# Altium schematic sheet BMS-S01-V00-BatteryManagementSystem.SchDoc: BMS Master
size A3; DrawnBy: Jonn Dillon; DocumentNumber: 1; Revision: 01; SheetNumber: 1; SheetTotal: 10; Version: 01; Project: Battery Managment System 2020; PageSetup: Record=PageOptions|CenterHorizontal=True|CenterVertical=True|PrintScale=0.97|XCorrection=1.00|YCorrection=1.00|PrintKind=0|BorderSize=5000000|LeftOffset=0|BottomOffset=0|Orientation=2|PaperLength=1000|PaperWidth=1000|Scale=100|PaperSource=7|PrintQuality=-4|MediaType=1|DitherType=10|PaperKind=A4|PrintScaleMode=1
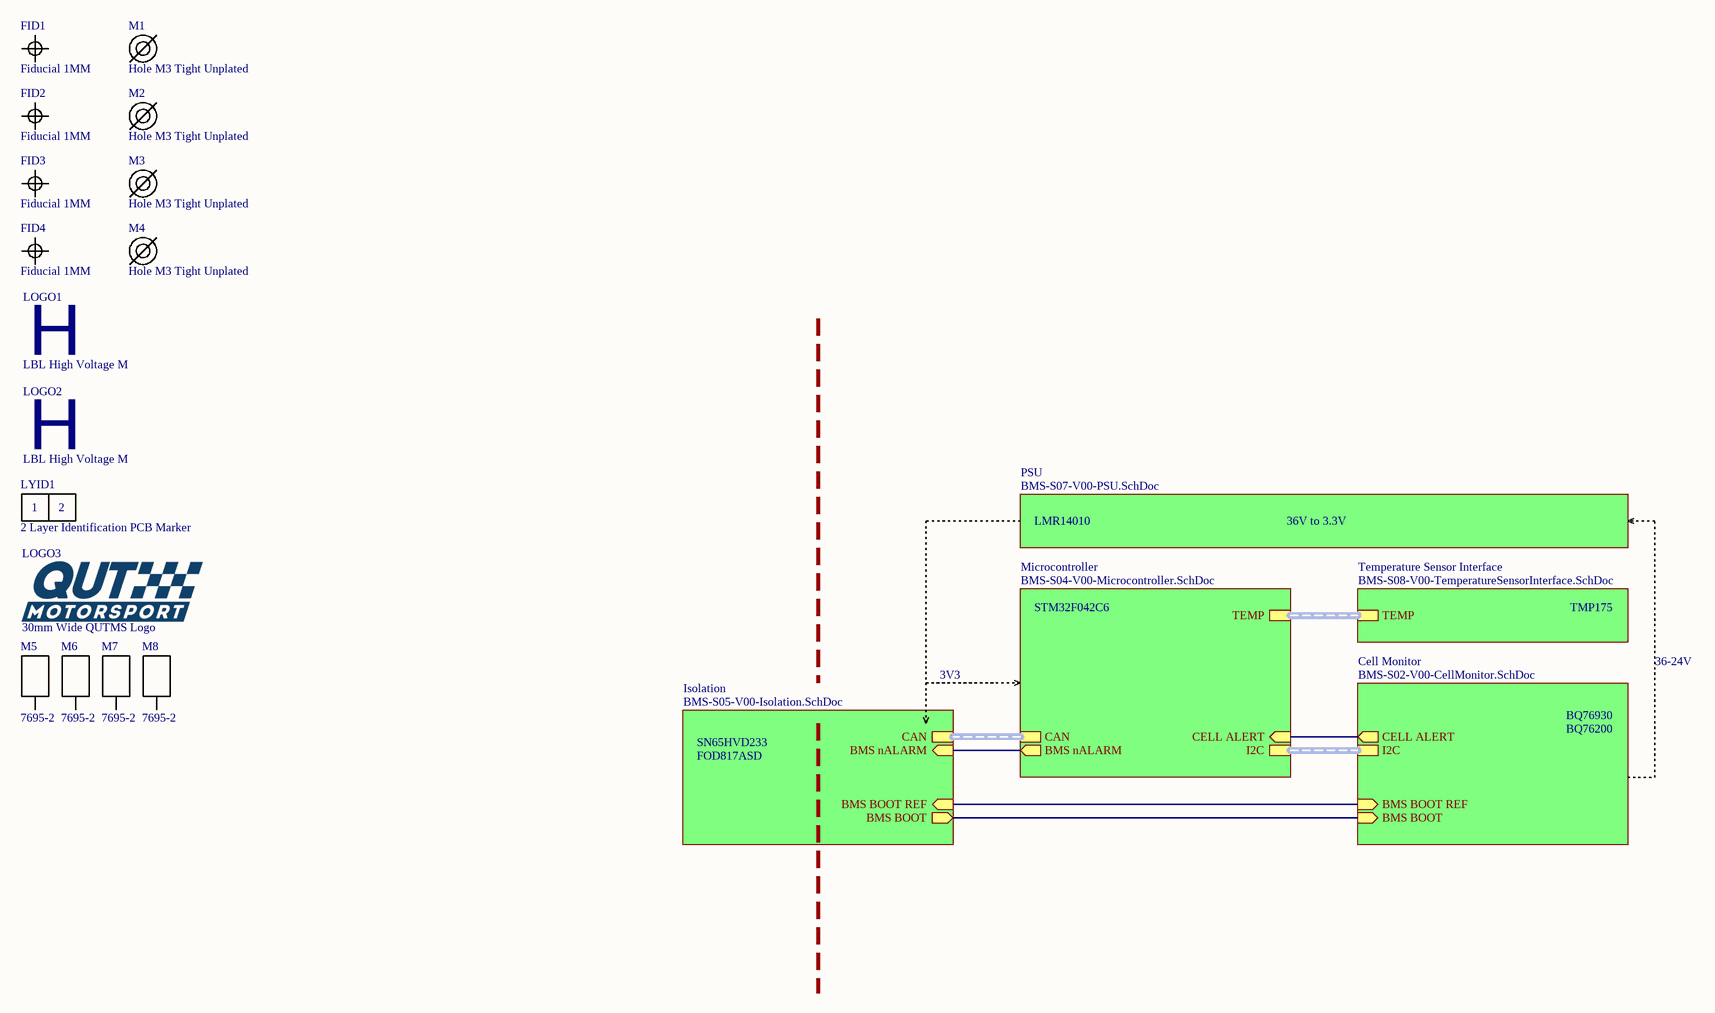
[diagram p0: BMS-S01-V00-BatteryManagementSystem.SchDoc]

## Parts
FID1  Fiducial 1MM  [FIDUCIAL 1MM]
FID2  Fiducial 1MM  [FIDUCIAL 1MM]
FID3  Fiducial 1MM  [FIDUCIAL 1MM]
FID4  Fiducial 1MM  [FIDUCIAL 1MM]
LOGO1  LBL High Voltage M  [LBL HV MEDIUM]
LOGO2  LBL High Voltage M  [LBL HV MEDIUM]
LOGO3  30mm Wide QUTMS Logo  [QUTMS LOGO 30MM]
LYID1  2 Layer Identification PCB Marker  [LAYER IDENT 2]
M1  Hole M3 Tight Unplated  [M3.2 UNPLATED]
M2  Hole M3 Tight Unplated  [M3.2 UNPLATED]
M3  Hole M3 Tight Unplated  [M3.2 UNPLATED]
M4  Hole M3 Tight Unplated  [M3.2 UNPLATED]
M5  7695-2  [Keystone 7790]
M6  7695-2  [Keystone 7790]
M7  7695-2  [Keystone 7790]
M8  7695-2  [Keystone 7790]

## Sub-sheets
Cell Monitor = BMS-S02-V00-CellMonitor.SchDoc: BMS BOOT REF (in), BMS BOOT (in), I2C (harness I2C), CELL ALERT (out)
Isolation = BMS-S05-V00-Isolation.SchDoc: BMS BOOT (out), BMS nALARM (in), BMS BOOT REF (in), CAN (harness CAN)
Microcontroller = BMS-S04-V00-Microcontroller.SchDoc: I2C (harness I2C), CAN (harness CAN), BMS nALARM (out), CELL ALERT (in), TEMP (harness TEMP)
PSU = BMS-S07-V00-PSU.SchDoc: no entries
Temperature Sensor Interface = BMS-S08-V00-TemperatureSensorInterface.SchDoc: TEMP (harness TEMP)

## Nets
(unnamed): sheet Isolation/BMS BOOT, sheet Cell Monitor/BMS BOOT
(unnamed): sheet Isolation/BMS nALARM, sheet Microcontroller/BMS nALARM
(unnamed): sheet Isolation/BMS BOOT REF, sheet Cell Monitor/BMS BOOT REF
(unnamed): sheet Microcontroller/CELL ALERT, sheet Cell Monitor/CELL ALERT

Not connected (* = marked no-connect by the designer): M5 0; M6 0; M7 0; M8 0

## Buses and harness runs
harness sheet Cell Monitor/I2C = sheet Microcontroller/I2C
harness sheet Isolation/CAN = sheet Microcontroller/CAN
harness sheet Microcontroller/TEMP = sheet Temperature Sensor Interface/TEMP

## Notes on the sheet
- LMR14010
- 36V to 3.3V
- STM32F042C6
- TMP175
- 3V3
- 36-24V
- SN65HVD233
- BQ76930
- BQ76200
- FOD817ASD
- Revision History:
- Sheet Title:
- Rev
- Date
- Description
- Project:
- Size:
- Drawn By:
- A3
- Number:
- Revision:
- Sheet
- Version:
- of
- QUT Motorsport
- O-120, Gardens Point
- 2 George Street
- Brisbane, QLD 4000
- Australia
- Print Date:
- Print Time:
- File Name:
- (in symbol Layer Identification 2) 1; 2
- (in symbol LBL High Voltage M) H

## Library data of the parts
LOGO3 = QUTMS Logo 30mm
LYID1 = Layer Identification 2
M1-M4 = Hole M3 Tight Unplated: M3.2 Hole, No Plating
M5-M8 = 7695-2: SNAP-INPC MOUNT